# EAGLE design interfacing_board (EAGLE 9.1.0)
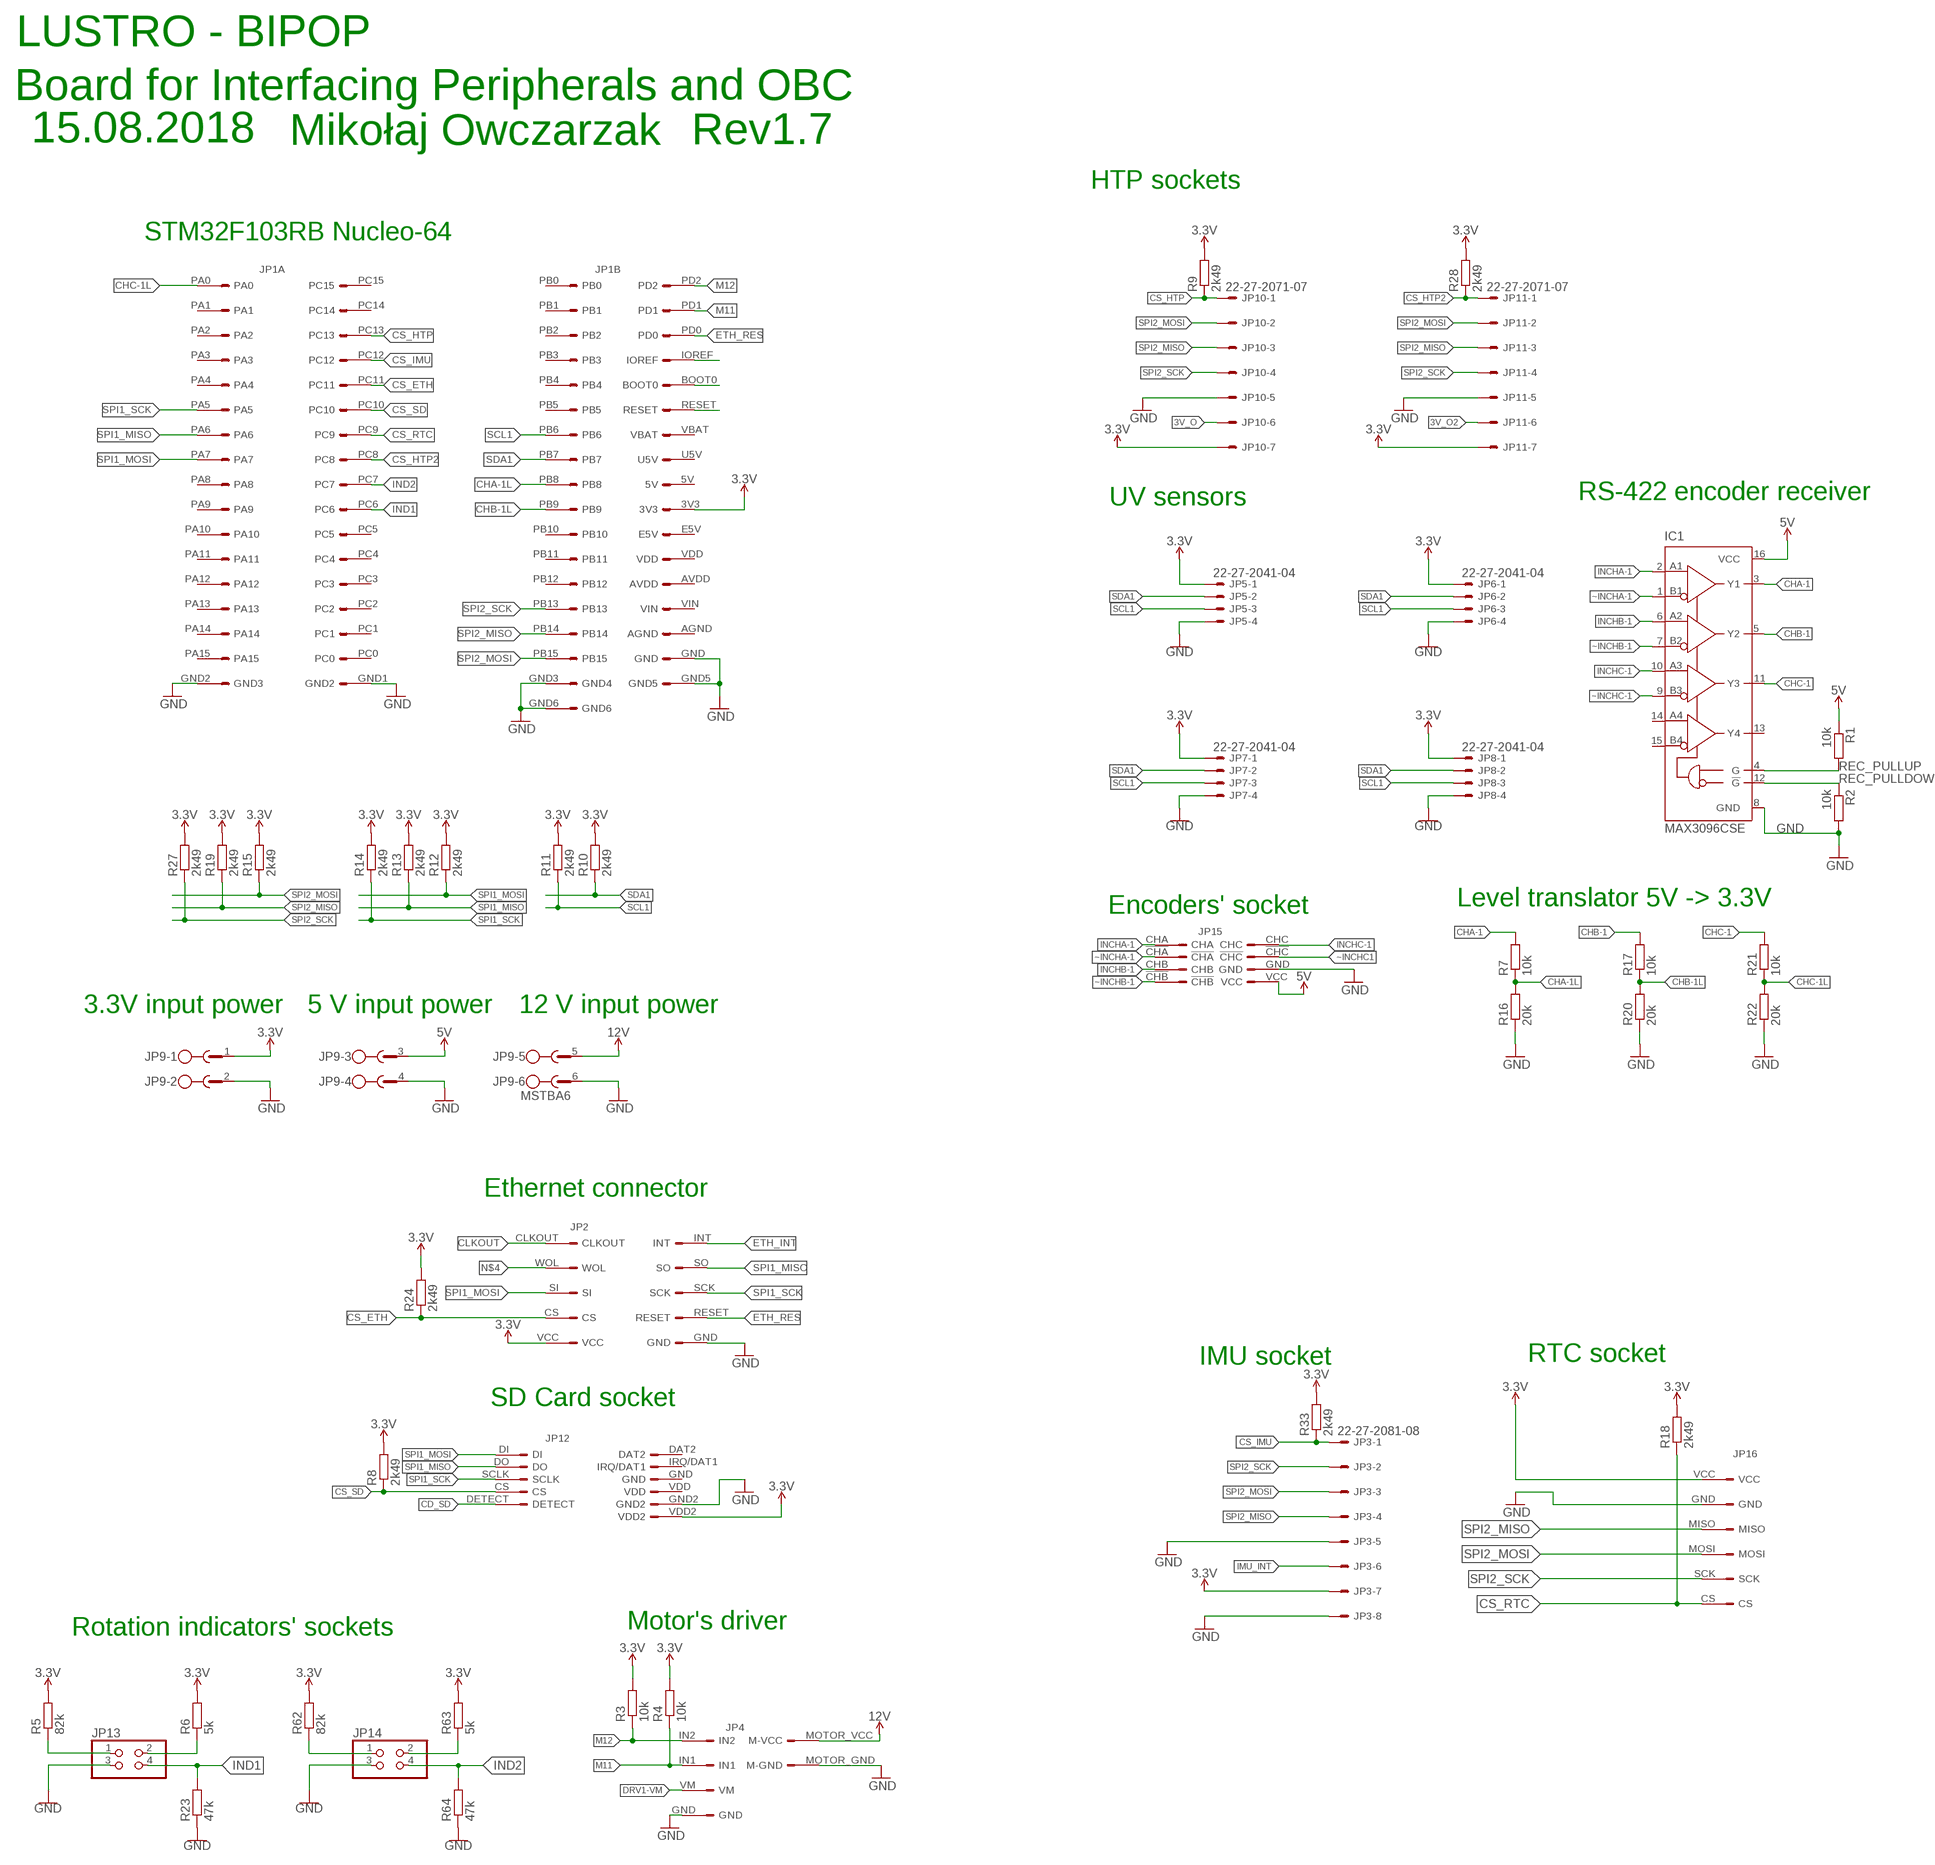
[diagram p0: schematic, sheet 1]

## Parts
IC1  MAX3096CSE  [SO16]
JP1A  JP1B  NUCLEOF103  [NUCLEO]
JP2  ETHERNET  [ETHERNET]
JP3  22-27-2081-08  [6410-08]
JP4  DRV8871  [DRIVER]
JP5  22-27-2041-04  [6410-04]
JP6  22-27-2041-04  [6410-04]
JP7  22-27-2041-04  [6410-04]
JP8  22-27-2041-04  [6410-04]
JP9  MSTBA6  [MSTBA6]
JP10  22-27-2071-07  [6410-07]
JP11  22-27-2071-07  [6410-07]
JP12  SD_2597  [SD]
JP13  PINHD-2X2  [2X02]
JP14  PINHD-2X2  [2X02]
JP15  ENX10  [SIL25]
JP16  RTC_WAVESHARE  [RTC]
R1  10k  R-EU_M0805  [M0805]
R2  10k  R-EU_M0805  [M0805]
R3  10k  R-EU_M0805  [M0805]
R4  10k  R-EU_M0805  [M0805]
R5  82k  R-EU_M0805  [M0805]
R6  5k  R-EU_M0805  [M0805]
R7  10k  R-EU_M0805  [M0805]
R8  2k49  R-EU_M0805  [M0805]
R9  2k49  R-EU_M0805  [M0805]
R10  2k49  R-EU_M0805  [M0805]
R11  2k49  R-EU_M0805  [M0805]
R12  2k49  R-EU_M0805  [M0805]
R13  2k49  R-EU_M0805  [M0805]
R14  2k49  R-EU_M0805  [M0805]
R15  2k49  R-EU_M0805  [M0805]
R16  20k  R-EU_M0805  [M0805]
R17  10k  R-EU_M0805  [M0805]
R18  2k49  R-EU_R0805  [R0805]
R19  2k49  R-EU_M0805  [M0805]
R20  20k  R-EU_M0805  [M0805]
R21  10k  R-EU_M0805  [M0805]
R22  20k  R-EU_M0805  [M0805]
R23  47k  R-EU_M0805  [M0805]
R24  2k49  R-EU_M0805  [M0805]
R27  2k49  R-EU_M0805  [M0805]
R28  2k49  R-EU_M0805  [M0805]
R33  2k49  R-EU_M0805  [M0805]
R62  82k  R-EU_M0805  [M0805]
R63  5k  R-EU_M0805  [M0805]
R64  47k  R-EU_M0805  [M0805]

## Nets
3.3V: JP1A.3V3 JP2.VCC JP3.7 JP5.1 JP6.1 JP7.1 JP8.1 JP9.1 JP10.7 JP11.7 JP12.VDD2 JP16.VCC R3.2 R4.2 R5.2 R6.2 R8.2 R9.2 R10.2 R11.2 R12.2 R13.2 R14.2 R15.2 R18.2 R19.2 R24.2 R27.2 R28.2 R33.2 R62.2 R63.2
3V_O: JP10.6
3V_O2: JP11.6
5V: IC1.16(VCC) JP9.3 JP15.VCC R1.1
12V: JP4.MOTOR_VCC(M-VCC) JP9.5
CD_SD: JP12.DETECT
CHA-1: IC1.3(Y1) R7.2
CHA-1L: JP1A.PB8 R7.1 R16.2
CHB-1: IC1.5(Y2) R17.2
CHB-1L: JP1A.PB9 R17.1 R20.2
CHC-1: IC1.11(Y3) R21.2
CHC-1L: JP1A.PA0 R21.1 R22.2
CLKOUT: JP2.CLKOUT
CS_ETH: JP1A.PC11 JP2.CS R24.1
CS_HTP: JP1A.PC13 JP10.1 R9.1
CS_HTP2: JP1A.PC8 JP11.1 R28.1
CS_IMU: JP1A.PC12 JP3.1 R33.1
CS_RTC: JP1A.PC9 JP16.CS R18.1
CS_SD: JP1A.PC10 JP12.CS R8.1
DRV1-VM: JP4.VM
ETH_INT: JP2.INT
ETH_RES: JP1A.PD0 JP2.RESET
GND: IC1.8(GND) JP1A.GND JP1A.GND1(GND2) JP1A.GND2(GND3) JP1A.GND3(GND4) JP1A.GND5 JP1A.GND6 JP2.GND JP3.5 JP3.8 JP4.GND JP4.MOTOR_GND(M-GND) JP5.4 JP6.4 JP7.4 JP8.4 JP9.2 JP9.4 JP9.6 JP10.5 JP11.5 JP12.GND2 JP13.3 JP14.3 JP15.GND JP16.GND R2.2 R16.1 R20.1 R22.1 R23.1 R64.1
IMU_INT: JP3.6
INCHA-1: IC1.2(A1) JP15.CHA
INCHB-1: IC1.6(A2) JP15.CHB
INCHC-1: IC1.10(A3) JP15.CHC
IND1: JP1A.PC6 JP13.4 R23.2
IND2: JP1A.PC7 JP14.4 R64.2
M11: JP1A.PD1 JP4.IN1 R4.1
M12: JP1A.PD2 JP4.IN2 R3.1
N$2: JP13.2 R6.1
N$4: JP2.WOL
N$7: JP13.1 R5.1
N$12: JP14.2 R63.1
N$15: JP14.1 R62.1
N$28: JP1A.RESET
N$29: JP1A.BOOT0
N$30: JP1A.IOREF
REC_PULLDOWN: IC1.12(!G) R2.1
REC_PULLUP: IC1.4(G) R1.2
SCL1: JP1A.PB6 JP5.3 JP6.3 JP7.3 JP8.3 R11.1
SDA1: JP1A.PB7 JP5.2 JP6.2 JP7.2 JP8.2 R10.1
SPI1_MISO: JP1A.PA6 JP2.SO JP12.DO R13.1
SPI1_MOSI: JP1A.PA7 JP2.SI JP12.DI R12.1
SPI1_SCK: JP1A.PA5 JP2.SCK JP12.SCLK R14.1
SPI2_MISO: JP1A.PB14 JP3.4 JP10.3 JP11.3 JP16.MISO R19.1
SPI2_MOSI: JP1A.PB15 JP3.3 JP10.2 JP11.2 JP16.MOSI R15.1
SPI2_SCK: JP1A.PB13 JP3.2 JP10.4 JP11.4 JP16.SCK R27.1
~INCHA-1: IC1.1(B1) JP15.!CHA
~INCHB-1: IC1.7(B2) JP15.!CHB
~INCHC1: JP15.!CHC
~INCHC-1: IC1.9(B3)
Unconnected: IC1.13(Y4) IC1.14(A4) IC1.15(B4) JP1A.5V JP1A.AGND JP1A.AVDD JP1A.E5V JP1A.PA1 JP1A.PA2 JP1A.PA3 JP1A.PA4 JP1A.PA8 JP1A.PA9 JP1A.PA10 JP1A.PA11 JP1A.PA12 JP1A.PA13 JP1A.PA14 JP1A.PA15 JP1A.PB0 JP1A.PB1 JP1A.PB2 JP1A.PB3 JP1A.PB4 JP1A.PB5 JP1A.PB10 JP1A.PB11 JP1A.PB12 JP1A.PC0 JP1A.PC1 JP1A.PC2 JP1A.PC3 JP1A.PC4 JP1A.PC5 JP1A.PC14 JP1A.PC15 JP1A.U5V JP1A.VBAT JP1A.VDD JP1A.VIN JP12.DAT2 JP12.GND JP12.IRQ/DAT1 JP12.VDD

## Notes on the sheet
- LUSTRO - BIPOP
- Board for Interfacing Peripherals and OBC
- 15.08.2018 | Mikołaj Owczarzak | Rev1.7
- HTP sockets
- STM32F103RB Nucleo-64
- UV sensors | RS-422 encoder receiver
- Encoders' socket | Level translator 5V -> 3.3V
- 3.3V input power | 5 V input power | 12 V input power
- Ethernet connector
- IMU socket | RTC socket
- SD Card socket
- Rotation indicators' sockets | Motor's driver

## Library data of the parts
IC1 = maxim:MAX309*: ±15kV ESD-Protected, 10Mbps, 3V/5V, Quad RS-422/RS-485 Receivers Source: http://pdfserv.maxim-ic.com/en/ds/MAX3095-MAX3096.pdf; MF: MAXIM; MPN: MAX3096CSE+; OC_FARNELL: unknown; OC_NEWARK: 67K4759
JP1A = customy:NUCLEOF103
JP2 = customy:ETHERNET
JP3 = EP_molex_6410_7395:22-?-08: CONNECTOR wire to board 2.54 mm (.1 inch) pitch header
JP4 = customy:DRV8871
JP5-JP8 = EP_molex_6410_7395:22-?-04: CONNECTOR wire to board 2.54 mm (.1 inch) pitch header
JP9 = con-phoenix-508:MSTBA6: PHOENIX; MF: FARNELL; MPN: 1757284; OC_FARNELL: 3705213; OC_NEWARK: 71C4165
JP10 JP11 = EP_molex_6410_7395:22-?-07: CONNECTOR wire to board 2.54 mm (.1 inch) pitch header
JP12 = customy:SD_2597
JP13 JP14 = pinhead:PINHD-2X2: PIN HEADER
JP15 = customy:ENX10
JP16 = customy:RTC_WAVESHARE
R1-R4 R7 R9-R22 R27 R28 R33 = rcl:R-EU_: RESISTOR, European symbol; SPICEPREFIX: R
R5 R6 R8 R23 R24 R62-R64 = resistor:R-EU_: RESISTOR, European symbol

## Board
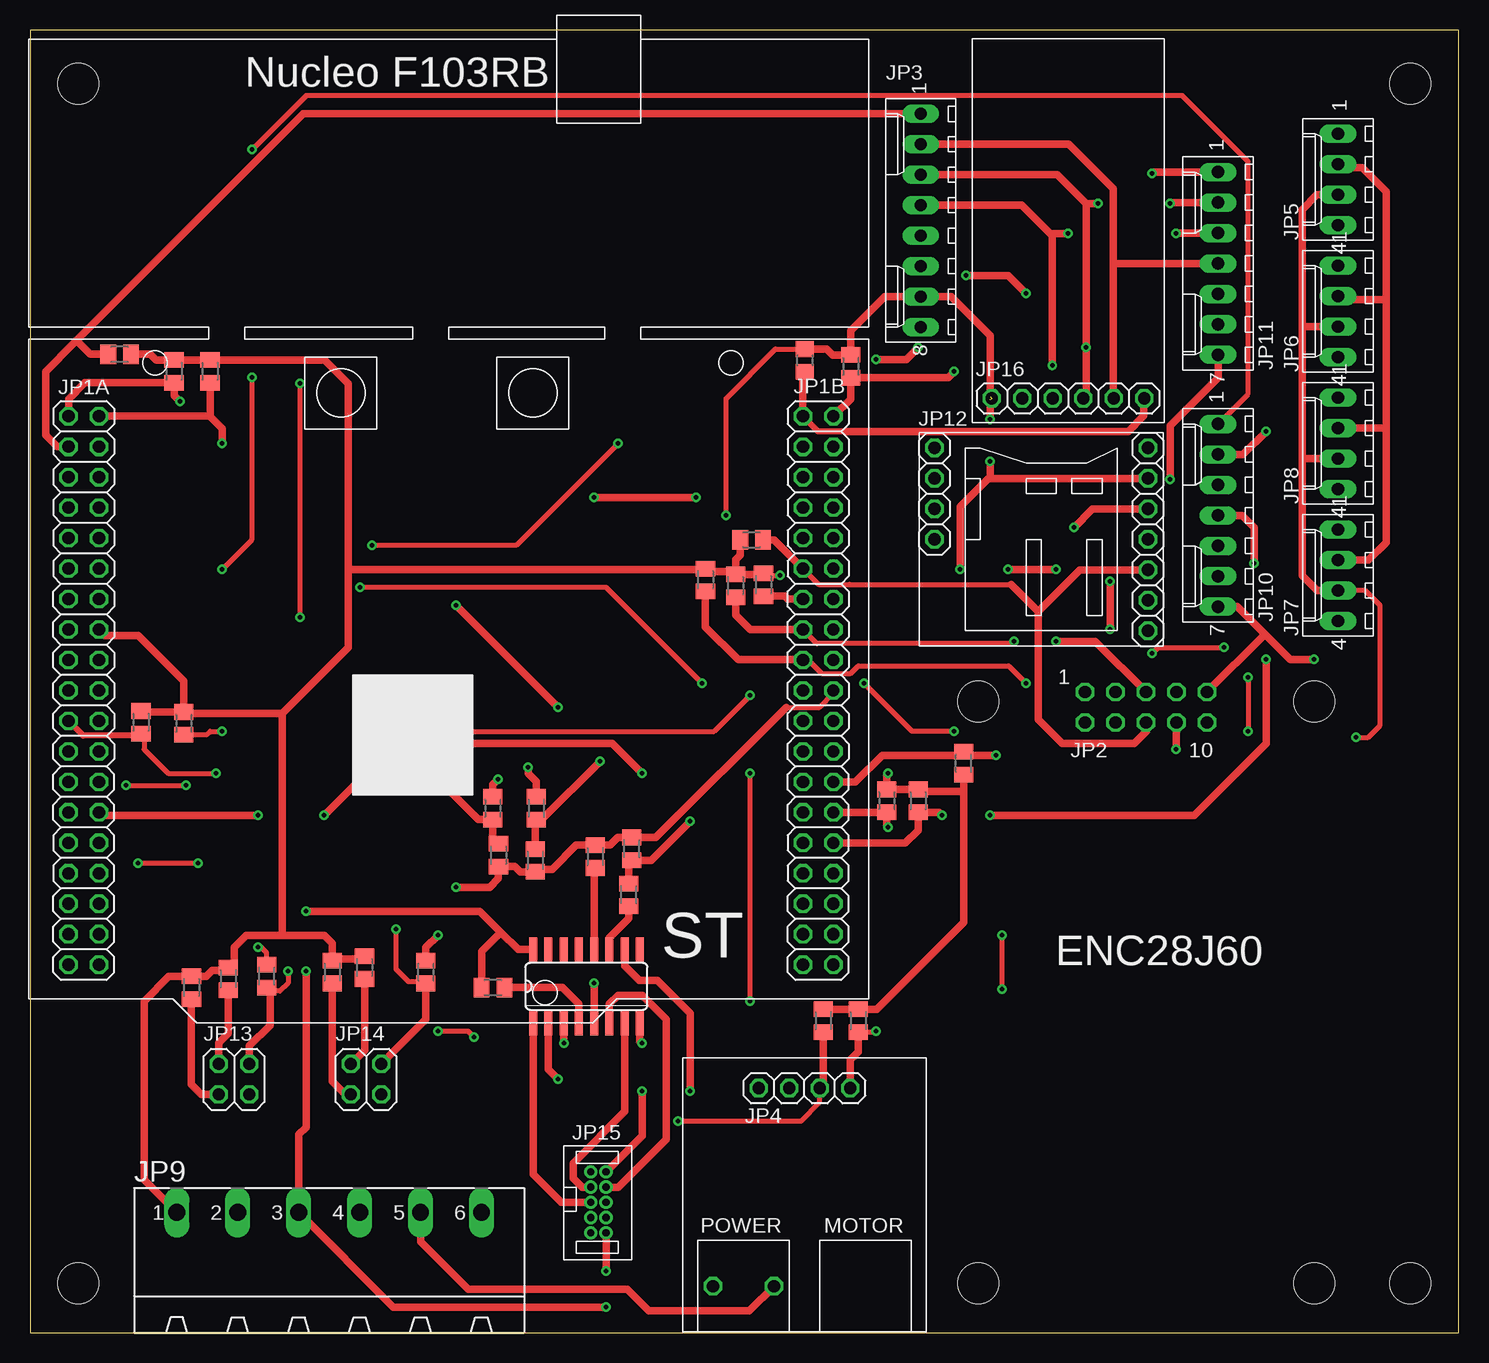
[diagram p1: board, top side]
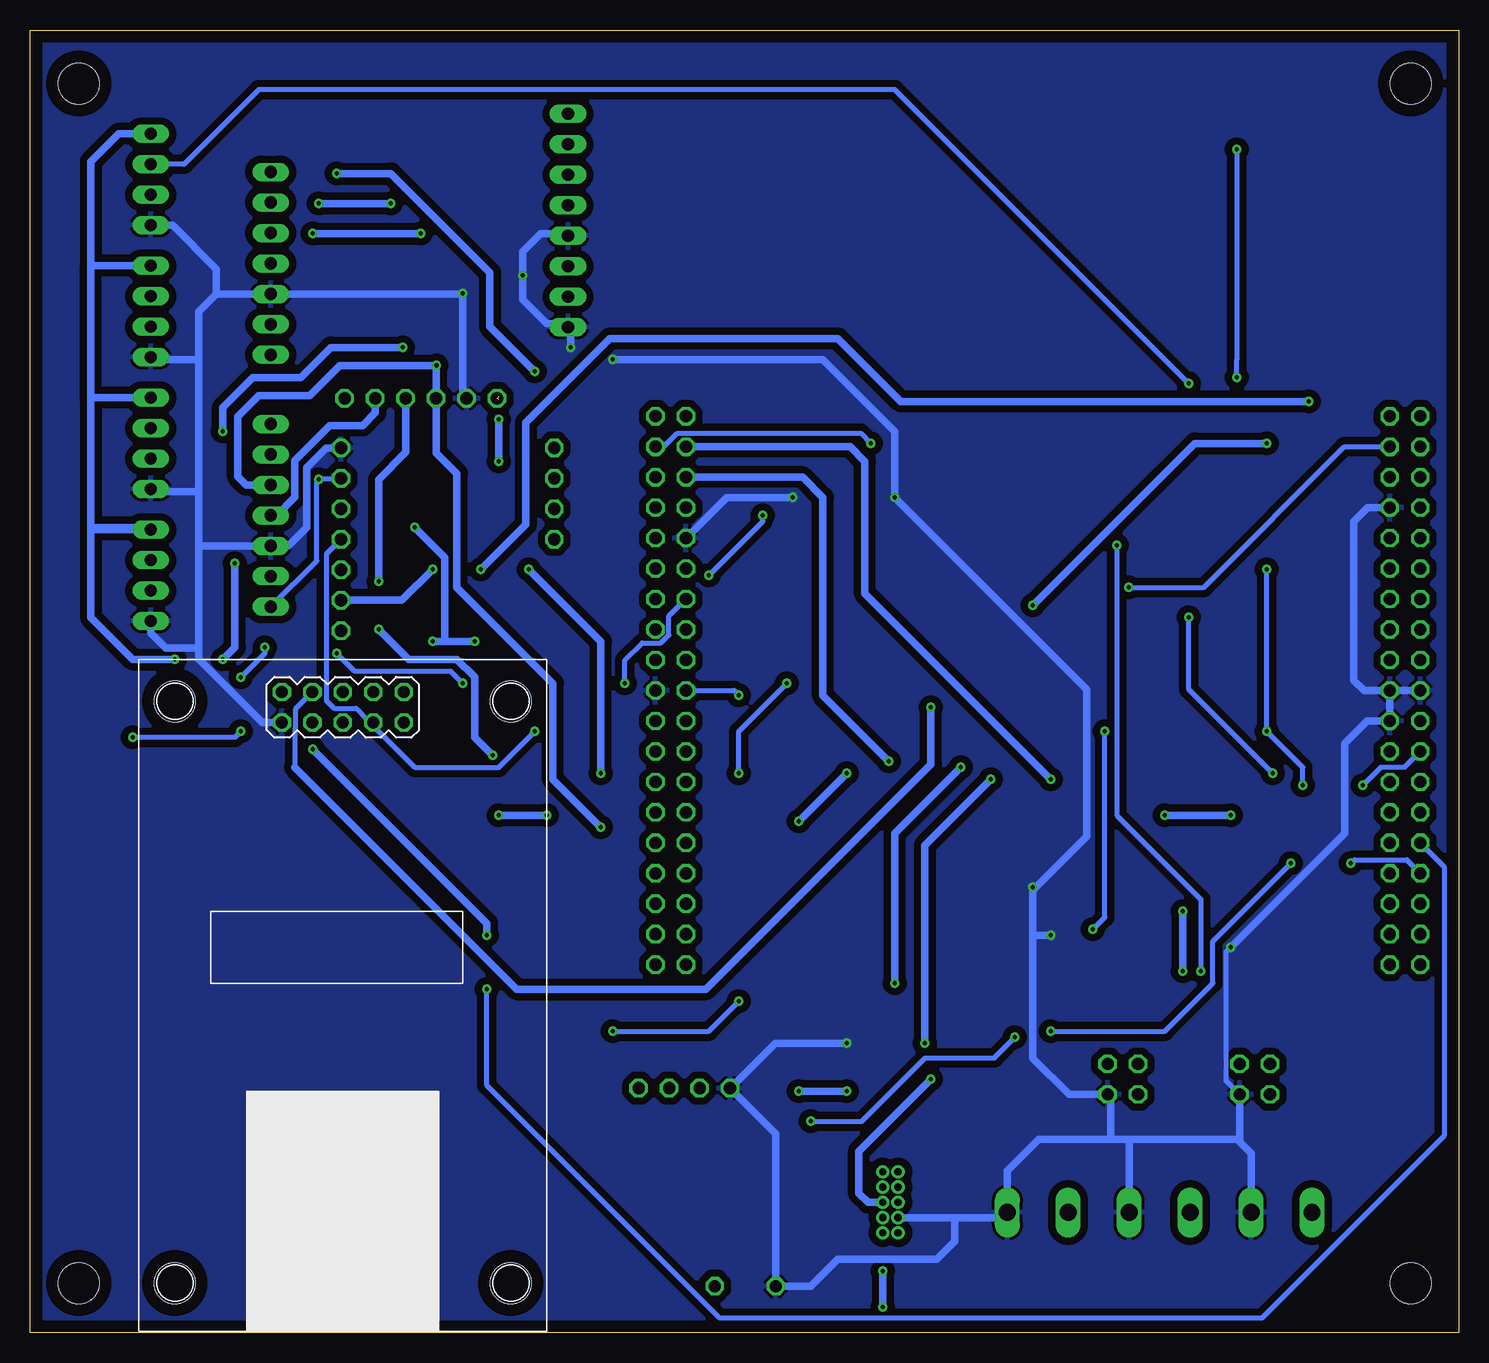
[diagram p2: board, bottom side, seen from below]

Size 119.07 x 108.6 mm. Coordinates in mm from the lower left corner, seen from the top.
Outline: 0,0 119.07,0 119.07,108.6 0,108.6 0,0
Copper layers (1*16): Top 0.035mm / dielectric 1.5mm / Bottom 0.035mm
Design rules "default": minimum track width 6mil, minimum drill 0.35mm, track to track 6mil, track to pad 6mil, pad to pad 6mil, via to via 6mil, smd to smd 6mil, copper to edge 40mil, drill to drill 6mil, minimum pad ring 10mil, minimum via ring 8mil, stop-mask expansion 4mil, vias tented up to drill 0mil, thermal gap 10mil
Holes 3.4 mm at 4,4.14 115,104.14 115,4.14 4,104.14 107,4.14 79,4.14 79,52.64 107,52.64

### Footprints (pad centres in the part's own frame; a part is rotated, then mirrored left to right if it is on the bottom)
SO16 = smd 0.66 x 2.032: 1 -4.445,-3.073; 2 -3.175,-3.073; 3 -1.905,-3.073; 4 -0.635,-3.073; 5 0.635,-3.073; 6 1.905,-3.073; 7 3.175,-3.073; 8 4.445,-3.073; 9 4.445,3.073; 10 3.175,3.073; 11 1.905,3.073; 12 0.635,3.073; 13 -0.635,3.073; 14 -1.905,3.073; 15 -3.175,3.073; 16 -4.445,3.073
NUCLEO = drill 1.016 octagon: 3V3 -27.25,-4.52; 5V -27.25,-7.06; 9 -29.79,3.1; 10 -27.25,3.1; 11 -29.79,0.56; 26 -27.25,-17.22; 48 33.95,3.1; 74 33.95,-29.92; 76 33.95,-32.46; AGND 33.95,-24.84; AVDD 31.41,5.64; BOOT0 -29.79,5.64; E5V -27.25,8.18; GND -27.25,5.64; GND1 -29.79,-9.6; GND2 -27.25,-9.6; GND3 -27.25,-12.14; GND5 31.41,3.1; GND6 33.95,-9.6; IOREF -27.25,0.56; PA0 -27.25,-19.76; PA1 -27.25,-22.3; PA2 31.41,-29.92; PA3 31.41,-32.46; PA4 -27.25,-24.84; PA5 31.41,0.56; PA6 31.41,-1.98; PA7 31.41,-4.52; PA8 31.41,-14.68; PA9 31.41,-12.14; PA10 31.41,-27.38; PA11 33.95,-1.98; PA12 33.95,0.56; PA13 -29.79,-1.98; PA14 -29.79,-4.52; PA15 -29.79,-7.06; PB0 -27.25,-27.38; PB1 33.95,-14.68; PB2 33.95,-12.14; PB3 31.41,-24.84; PB4 31.41,-19.76; PB5 31.41,-22.3; PB6 31.41,-7.06; PB7 -29.79,-12.14; PB8 31.41,10.72; PB9 31.41,8.18; PB10 31.41,-17.22; PB11 33.95,-7.06; PB12 33.95,-4.52; PB13 33.95,-22.3; PB14 33.95,-19.76; PB15 33.95,-17.22; PC0 -27.25,-32.46; PC1 -27.25,-29.92; PC2 -29.79,-29.92; PC3 -29.79,-32.46; PC4 33.95,-27.38; PC5 33.95,8.18; PC6 33.95,10.72; PC7 31.41,-9.6; PC8 33.95,13.26; PC9 31.41,13.26; PC10 -29.79,13.26; PC11 -27.25,13.26; PC12 -29.79,10.72; PC13 -29.79,-14.68; PC14 -29.79,-17.22; PC15 -29.79,-19.76; PD0 -29.79,-22.3; PD1 -29.79,-24.84; PD2 -27.25,10.72; RESET -27.25,-1.98; U5V 33.95,5.64; VBAT -29.79,-27.38; VDD -29.79,8.18; VIN -27.25,-14.68
ETHERNET = drill 1.016 octagon: CLKOUT 11.92,2.73; CS 19.54,2.73; GND 22.08,5.27; INT 11.92,5.27; RESET 19.54,5.27; SCK 17,5.27; SI 17,2.73; SO 14.46,5.27; VCC 22.08,2.73; WOL 14.46,2.73
6410-08 = drill 1.016 long: 1 8.89,0; 2 6.35,0; 3 3.81,0; 4 1.27,0; 5 -1.27,0; 6 -3.81,0; 7 -6.35,0; 8 -8.89,0
DRIVER = drill 1.016 octagon: GND 1.27,0; IN1 -3.81,0; IN2 -6.35,0; MOTOR_GND 5.08,16.51; MOTOR_VCC 0,16.51; VM -1.27,0
6410-04 = drill 1.016 long: 1 3.81,0; 2 1.27,0; 3 -1.27,0; 4 -3.81,0
MSTBA6 = drill 1.397 long: 1 -12.7,5.08; 2 -7.62,5.08; 3 -2.54,5.08; 4 2.54,5.08; 5 7.62,5.08; 6 12.7,5.08
6410-07 = drill 1.016 long: 1 7.62,0; 2 5.08,0; 3 2.54,0; 4 0,0; 5 -2.54,0; 6 -5.08,0; 7 -7.62,0
SD = drill 1.016 octagon: CS 10.16,-5.08; DAT2 -7.62,2.54; DETECT 10.16,-7.62; DI 10.16,2.54; DO 10.16,0; GND -7.62,7.62; GND2 10.16,7.62; IRQ/DAT1 -7.62,0; SCLK 10.16,-2.54; VDD -7.62,5.08; VDD2 10.16,5.08
2X02 = drill 1.016 octagon: 1 -1.27,-1.27; 2 -1.27,1.27; 3 1.27,-1.27; 4 1.27,1.27
SIL25 = drill 0.6 pad 1.016: !CHA -1.27,0.27; !CHB 0,0.27; !CHC 1.27,0.27; CHA -1.27,-1; CHB 0,-1; CHC 1.27,-1; DNC -3.81,0.27; DNC2 -2.54,-1; GND -2.54,0.27; VCC -3.81,-1
RTC = drill 1.016 octagon: CS 6.35,0; GND -3.81,0; MISO -1.27,0; MOSI 1.27,0; SCK 3.81,0; VCC -6.35,0
M0805 = smd 1.3 x 1.6: 1 -0.95,0; 2 0.95,0
R0805 = smd 1.3 x 1.5: 1 -0.95,0; 2 0.95,0

### Placement (x,y rotation side)
IC1  46.37,28.88 0 top
JP1A  33,63.14 0 top
JP2  76,56.14 180 bottom
JP3  74.23,92.72 90 top
JP4  62,20.39 180 top
JP5  109,96.14 90 top
JP6  109,85.14 90 top
JP7  109,63.14 90 top
JP8  109,74.14 90 top
JP9  24.93,4.95 0 top
JP10  99,68.14 90 top
JP11  99,89.14 90 top
JP12  83,66.14 0 top
JP13  17,21.14 0 top
JP14  28,21.14 0 top
JP15  47,12.14 90 top
JP16  86.5,77.89 0 top
R1  38.58,28.77 0 top
R2  47.1,39.7 90 top
R3  69.02,26.01 90 top
R4  66.1,26.01 90 top
R5  13.45,28.77 90 top
R6  16.53,29.5 90 top
R7  38.56,43.72 90 top
R8  12,80.14 90 top
R9  12.82,50.8 90 top
R10  9.25,50.88 90 top
R11  56.29,62.75 90 top
R12  58.8,62.27 90 top
R13  61.12,62.35 90 top
R14  60.14,66.1 180 top
R15  77.8,47.48 270 top
R16  39.04,39.81 90 top
R17  42.18,43.72 90 top
R18  64.58,81.05 90 top
R19  71.39,44.34 90 top
R20  42.1,39.37 90 top
R21  49.9,36.5 270 top
R22  50.14,40.34 270 top
R23  19.72,29.72 270 top
R24  15,80.14 90 top
R27  74.01,44.34 90 top
R28  68.39,80.56 90 top
R33  7.47,81.56 0 top
R62  25.18,30.07 90 top
R63  27.88,30.45 90 top
R64  32.99,30.07 270 top

### Tracks (layer width: path | path; a pad name or v marks a point on that pad's centre or on a via)
3.3V  (via drill 0.35)  (2 unrouted)
  Top 0.406: R13.2 61.28,63.14 v62.5,63.14 | v58,68.14 58,77.89 62.11,82 R18.2
  Top 0.61: R13.2 61.04,63.22 R12.2 | R33.2 10.03,81.56 10.5,81.09 R8.2 R24.2 24.55,81.09 26.5,79.14 26.5,63.64 | R12.2 58.8,64.46 59.19,64.85 R14.2 | R18.2 66.4,82 66.89,81.51 R28.2 68.39,83.53 71.23,86.37 JP3.7 76.77,86.37 80,83.14 80,78.03 | R4.2 R3.2 70.57,26.96 77.8,34.19 R15.2 77.8,45.14 75.75,45.14 74.16,45.14 R27.2 R19.2 71.39,46.53 v71.5,46.64 | R9.2 9.33,51.75 R10.2 | JP1A.3V3 6.23,58.14 9,58.14 12.82,54.32 R9.2 | 21,33.14 18,33.14 17,32.14 17,30.92 R6.2 16.28,30.2 15.18,30.2 14.7,29.72 R5.2 11.58,29.72 9.5,27.64 9.5,12.76 JP9.1 | 21,33.14 24.5,33.14 25.18,32.46 R62.2 25.43,31.02 25.56,31.15 27.88,31.15 R63.2 | v107,56.14 105,56.14 103,58.14 | JP10.7 100.62,60.52 103,58.14 | JP2.VCC 102.81,58.14 103,58.14 | JP12.VDD2 80,71.22 80,71.39 | v80,76.14 80,77.79 | R9.2 12.93,51.64 21,51.64 | 21,51.64 21,33.14 | 80,71.39 77.5,68.89 v77.5,63.64 | 80,71.39 v80,72.64 | 21,51.64 22.5,53.14 26.5,57.14 26.5,63.64 | 26.5,63.64 56.23,63.64 R11.2 56.52,63.47 58.55,63.47 R12.2 | v95,71.14 95,75.64 99,79.64 JP11.7
  Bottom 0.406: JP10.7 95.17,64.35 95.17,70.97 v95,71.14 94.92,71.22 JP12.VDD2 | v62.5,63.14 58,67.64 v58,68.14 | 113.75,77.95 113.94,77.76 114,77.76
  Bottom 0.61: JP8.1 113.75,77.95 | JP6.1 114,88.95 | JP5.1 111.69,99.95 114,97.64 114,88.95 | v107,56.14 110.5,56.14 114,59.64 114,66.95 JP7.1 109.19,67.14 114,67.14 114,77.76 114,88.95 | v80,72.64 v80,76.14 | v71.5,46.64 71.5,57.64 v77.5,63.64
5V  (via drill 0.35)
  Top 0.61: v48,2.14 30.28,2.14 JP9.3 22.39,16.53 23,17.14 v23,30.14 | v23,35.14 37.49,35.14 38.62,34.01 39.24,33.38 | 39.24,33.38 40.67,31.95 IC1.16 | JP15.VCC v48,5.14 | R1.1 37.63,31.77 39.24,33.38
  Bottom 0.61: v23,30.14 v23,35.14 | v48,5.14 v48,2.14
12V
  Top 0.61: JP9.5 32.55,7.59 36.5,3.64 49.75,3.64 51.57,1.82 59.94,1.82 JP4.MOTOR_VCC
CHA-1  (via drill 0.35)
  Top 0.61: R7.2 38.56,45.7 v39,46.14 | v44.5,24.14 44.47,24.14 IC1.3
  Bottom 0.61: v39,46.14 44.5,40.64 v44.5,24.14
CHA-1L  (via drill 0.35)
  Top 0.61: R16.2 38.56,41.24 R7.1 37.37,42.77 v34,46.14
  Bottom 0.61: v34,46.14 49.5,61.64 49.5,72.64 50.72,73.86 JP1A.PB8
CHB-1  (via drill 0.35)
  Top 0.61: IC1.5 v47,29.14 | v41.5,47.14 41.5,46.64 42.18,45.96 R17.2
  Bottom 0.61: v47,29.14 47,41.64 v41.5,47.14
CHB-1L  (via drill 0.35)
  Top 0.61: R20.2 42.1,42.69 R17.1 42.63,42.77 v47.5,47.64
  Bottom 0.61: v47.5,47.64 53,53.14 53,69.64 54.68,71.32 JP1A.PB9
CHC-1
  Top 0.61: IC1.11 48.27,32.92 49.9,34.55 R21.2
CHC-1L  (via drill 0.35)
  Top 0.61: R21.1 49.9,39.15 R22.2 51.75,39.39 v55,42.64 | JP1A.PA0 5.99,43.14 v19,43.14 | v24.5,43.14 30.5,49.14 48.5,49.14 v51,46.64
  Bottom 0.61: v19,43.14 v24.5,43.14 | v51,46.64 v55,42.64
CS_ETH  (via drill 0.35)
  Top 0.61: 14.99,76.4 15,76.4 R24.1 | v44,52.14 v35.5,60.64 | 14.99,76.4 16,75.39 v16,74.14 | JP1A.PC11 14.26,76.4 14.99,76.4
  Bottom 0.406: 97,47.14 97,50.37 96.96,50.41 96.96,51.99 JP2.CS
  Bottom 0.61: 97,47.14 78.5,28.64 62.75,28.64 44,47.39 v44,52.14 | v35.5,60.64 22,74.14 v16,74.14
CS_HTP  (via drill 0.35)
  Top 0.406: R9.1 14.71,49.85 15,50.14 v16,50.14 | v16,63.64 18.5,66.14 v18.5,79.64 | JP10.1 101.5,78.26 101.5,97.64 96,103.14 23,103.14 v18.5,98.64 | v8,45.64 v13,45.64
  Bottom 0.406: v16,63.64 v16,50.14 15.75,49.89 13,47.14 v13,45.64 | v18.5,79.64 18.5,81.14 v18.5,98.64 | JP1A.PC13 4.5,47.17 4.5,47.14 6.5,47.14 v8,45.64
CS_HTP2  (via drill 0.35)
  Top 0.61: JP1A.PC8 68.39,77.84 R28.1 68.42,79.64 76.5,79.64 v77,80.14 | JP11.1 93.62,96.76 v93.5,96.64
  Bottom 0.61: v93.5,96.64 89,96.64 80.75,88.39 80.75,83.89 v77,80.14
CS_IMU
  Top 0.61: JP3.1 22.79,101.61 4.66,83.48 3.66,82.48 | JP1A.PC12 2.28,73.86 1.32,74.82 1.32,80.14 3.66,82.48 | R33.1 5.02,81.56 3.88,82.7 3.66,82.48
CS_RTC
  Top 0.508: 68,75.14 65.67,75.14 JP1A.PC9
  Top 0.61: JP1A.PC9 64.41,79.93 R18.1 | 68,75.14 78,75.14 91.5,75.14 92.82,76.46 92.82,77.86 JP16.CS
CS_SD  (via drill 0.35)
  Top 0.61: JP1A.PC10 3.21,77.85 4.55,79.19 R8.1 12,78.14 v12.5,77.64 | v81.5,63.64 v85.5,63.64
  Bottom 0.61: v12.5,77.64 46.5,77.64 51.75,82.89 70.75,82.89 77.75,75.89 77.75,67.39 v81.5,63.64 | v85.5,63.64 88.08,61.06 JP12.CS
ETH_RES  (via drill 0.35)
  Top 0.406: v81,28.64 v81,33.14
  Top 0.61: JP2.RESET 95.54,48.68 v95.5,48.64
  Bottom 0.406: JP1A.PD0 1.22,38.85 1.22,16.42 16.42,1.22 61.58,1.22 69.5,9.14 81,20.64 v81,28.64
  Bottom 0.61: v95.5,48.64 81,34.14 v81,33.14
GND  (via drill 0.35)
  Top 0.406: 63,52.14 65.8,52.14 66.95,53.29 JP1A.GND6 | v19,32.14 19.25,32.14 19.72,31.67 R23.1
  Top 0.61: v51,24.14 51,24.12 50.81,24.31 IC1.8 | R64.1 32.99,32.13 v34,33.14 | v83,86.64 81.5,88.14 v78,88.14 | v35.5,37.14 38.32,37.14 39.04,37.86 R16.1 40.41,38.86 40.85,38.42 R20.1 42.32,38.64 43.5,38.64 45.51,40.65 R2.2 48.35,40.65 48.99,41.29 R22.1 52.15,41.29 63,52.14 | v55.5,69.64 v47,69.64 | v74,82.14 73,81.14 v70.5,81.14
  Bottom 0.406: JP13.3 19.39,20.99 19.39,31.75 v19,32.14 | 105.06,57.08 105,57.14 | JP1A.GND5
  Bottom 0.61: 103.54,86.6 JP11.5 83,86.6 83,78.25 | 103.54,86.6 105,85.14 105,81.14 | JP6.4 108.81,81.14 105,81.14 | JP5.4 107.19,92.33 103.54,88.68 103.54,87.1 103.54,86.6 | 105,70.14 105,80.14 105,81.14 | 105,70.14 106,70.14 108.81,70.14 JP8.4 | 105,65.39 105,70.14 | 105,65.39 104.79,65.6 JP10.5 97.54,65.6 96,67.14 96,72.14 94.38,73.76 JP12.GND2 | JP2.GND 99.73,50.87 104.94,56.08 105,56.14 105,57.14 105,65.14 105,65.39 | JP9.2 17.31,14.95 18.27,15.91 18.27,16.14 | 18.27,16.14 JP13.3 | 29,16.14 35,16.14 37.63,13.51 JP9.6 38.06,9.6 42,9.6 | 29,16.14 27,16.14 26.5,16.14 | 29,16.14 29,19.6 JP14.3 32.48,19.87 35.5,22.89 35.5,32.64 35.5,33.14 | JP9.4 27.47,16.14 27.5,16.14 26.5,16.14 | JP15.GND 42,9.6 | 42,9.6 42,7.64 43.5,6.14 51.75,6.14 54.01,3.88 JP4.MOTOR_GND 56.92,16.58 JP4.GND 56.98,24.14 v51,24.14 | 35.5,33.14 v34,33.14 | 35.5,33.14 35.5,33.64 v35.5,37.14 35.38,37.02 31,41.39 31,53.64 v47,69.64 47,75.14 53,81.14 v70.5,81.14 | v19,32.14 9.5,41.64 9.5,49.14 7.64,51 JP1A.GND3 JP1A.GND2 | v74,82.14 74,83.6 JP3.8 74.54,84.14 76,84.14 78,86.14 78,87.64 v78,88.14 78,90.14 76.5,91.64 74.42,91.64 JP3.5 | JP1A.GND5 61,69.64 v55.5,69.64 | 26.5,16.14 18.27,16.14 | JP7.4 109,58.33 107.75,57.08 105.06,57.08 105.06,57.2 | JP1A.GND2 JP1A.GND1 | JP1A.GND2 7.9,53.54 8.75,54.39 8.75,67.64 7.61,68.78 JP1A.GND
  pour Bottom (isolate 0.61): 0.5,108.14 118.5,108.14 118.5,0.64 0.5,0.64
INCHA-1  (via drill 0.35)
  Top 0.61: v44,21.14 43.2,21.95 IC1.2
  Bottom 0.61: JP15.CHA 49.23,10.87 50,11.64 50,15.14 46,19.14 v44,21.14
INCHB-1
  Top 0.61: IC1.6 48.27,27.41 49,28.14 51,28.14 53,26.14 53,16.14 49,12.14 JP15.CHB
INCHC-1  (via drill 0.35)
  Top 0.61: JP15.CHC 51,16.41 v51,20.14 | v55,20.14 55,26.64 52.25,29.39 50.75,29.39 49.55,30.59 IC1.10
  Bottom 0.61: v51,20.14 v55,20.14
IND1  (via drill 0.35)
  Top 0.406: v49,74.14 40.5,65.64 v28.5,65.64 | v21.5,30.14 21.5,29.14 20.85,28.49 20,28.49
  Top 0.61: JP13.4 18.27,23.91 20,25.64 20,28.49 R23.2
  Bottom 0.406: JP1A.PC6 66.24,73.86 65.12,74.98 55.41,74.98 54.66,74.98 54.16,74.98 53.66,74.98 49.84,74.98 v49,74.14 | v28.5,65.64 28.5,43.14 21.5,36.14 v21.5,30.14
IND2  (via drill 0.35)
  Top 0.406: v60,53.14 57,50.14 v29.5,50.14 | R64.2 32.85,29.26 31.54,29.26 30.5,30.31 v30.5,33.64
  Top 0.61: R64.2 32.99,26.13 JP14.4
  Bottom 0.406: JP1A.PC7 60.4,53.54 v60,53.14 | v30.5,33.64 29.5,34.64 v29.5,50.14
M11  (via drill 0.35)
  Top 0.406: v54,17.64 64.25,17.64 65.81,19.2 JP4.IN1 | v37,24.64 36.5,25.14 v34,25.14 | v14,39.14 v9,39.14
  Top 0.61: R4.1 66.1,20.81 65.81,20.52 JP4.IN1
  Bottom 0.406: v54,17.64 49.75,17.64 44.48,22.91 38.7,22.91 37,24.6 v37,24.64 | v34,25.14 24.5,25.14 20.5,29.14 20.5,32.64 v14,39.14 | v9,39.14 v8.99,39.14 8.71,39.42 4.33,39.42 JP1A.PD1
M12  (via drill 0.35)
  Top 0.406: R3.1 70.42,25.06 v70.5,25.14 | v60,27.64 v60,46.64 | v56,54.14 48,62.14 v27.5,62.14
  Top 0.61: R3.1 69.02,23.4 68.35,22.73 JP4.IN2
  Bottom 0.406: v70.5,25.14 62.5,25.14 v60,27.64 | v60,46.64 60,50.14 v56,54.14 | v27.5,62.14 21.25,62.14 9.53,73.86 JP1A.PD2
N$2
  Top 0.61: R6.1 16.53,24.96 15.73,24.16 JP13.2
N$7
  Top 0.61: R5.1 13.45,20.69 14.27,19.87 JP13.1
N$12
  Top 0.61: R63.1 27.88,23.52 26.77,22.41 JP14.2
N$15
  Top 0.61: R62.1 25.18,20.96 26.27,19.87 JP14.1
REC_PULLDOWN
  Top 0.61: R2.1 47.01,38.66 IC1.12
REC_PULLUP
  Top 0.61: IC1.4 45.73,27.41 44.37,28.77 R1.2
SCL1  (via drill 0.35)
  Top 0.406: v83,54.14 81.56,55.58 69.03,55.58 68.41,54.96 65.99,54.96 64.87,56.08 JP1A.PB6 | v93.5,56.64 94,57.14 v99.5,57.14 | v101.5,54.64 v101.5,50.14 | JP7.3 111.27,61.87 112.5,60.64 112.5,50.64 111.5,49.64 v110.5,49.64 | 106,72.85 106,72.87
  Top 0.61: JP1A.PB6 64.35,56.14 59,56.14 56.29,58.85 R11.1 | JP5.3 107.23,94.87 106,93.64 106,85.14 | 106,85.14 106,83.87 JP6.3 | JP7.3 107.27,61.87 106,63.14 106,72.85 | 106,85.14 106,72.87 JP8.3
  Bottom 0.406: v83,54.14 84,55.14 92,55.14 v93.5,56.64 | v101.5,54.64 99.5,56.64 v99.5,57.14 | v101.5,50.14 102,49.64 v110.5,49.64
SDA1  (via drill 0.35)
  Top 0.406: R10.1 9.5,49.68 9.5,48.64 11.5,46.64 v15.5,46.64 | v22.5,59.64 v22.5,79.14
  Top 0.508: JP1A.PB7 4.43,49.78 9.1,49.78 R10.1
  Top 0.61: JP5.2 109.27,97.14 111,97.14 113,95.14 113,86.14 | 113,86.14 109.27,86.14 JP6.2 | 113,75.41 111.27,75.41 JP8.2 | 113,75.41 113,85.14 113,86.14 | JP7.2 111.52,64.41 113,65.89 113,75.41
  Bottom 0.406: v15.5,46.64 22.5,53.64 v22.5,59.64 | v22.5,79.14 47,103.64 100,103.64 106.23,97.41 JP5.2
SPI1_MISO  (via drill 0.35)
  Top 0.406: v77,50.14 73.5,50.14 v69.5,54.14
  Top 0.61: R13.1 62.91,61.41 63.16,61.16 JP1A.PA6
  Bottom 0.406: JP12.DO 94.37,64.93 94.37,52.7 93.71,52.04 91.9,52.04 90.96,51.1 90.69,51.1 JP2.SO 90.46,50.6 87,47.14 80,47.14 v77,50.14 | v69.5,54.14 69.5,56.07 68.07,57.5 66.49,57.5 65.83,58.16 65.83,59.74 JP1A.PA6
SPI1_MOSI  (via drill 0.35)
  Top 0.406: v82,57.64 81.81,57.45 65.58,57.45 JP1A.PA7
  Top 0.61: JP1A.PA7 60.02,58.62 58.8,59.84 R12.1 | JP2.SI 88.77,57.64 v85.5,57.64 | v87,67.14 88.54,68.68 JP12.DI
  Bottom 0.61: v85.5,57.64 84.5,57.64 | 84.5,57.64 v82,57.64 | v87,67.14 84.5,64.64 84.5,57.64
SPI1_SCK
  Top 0.406: 81.75,62.39 68.3,62.39 65.72,62.39 JP1A.PA5
  Top 0.61: JP1A.PA5 62.73,65.38 62.01,66.1 R14.1 | JP2.SCK 93,50.14 92,49.14 86,49.14 84,51.14 84,60.14 | 84,60.14 87.46,63.6 JP12.SCLK | 84,60.14 81.75,62.39
SPI2_MISO  (via drill 0.35)
  Top 0.61: JP1A.PB14 R19.1 71.39,42.25 v71.5,42.14 | JP3.4 82.65,93.99 85.2,91.44 85.2,90.94 | JP11.3 95.54,91.68 v95.5,91.64 | v86.5,91.64 85.2,91.64 85.2,90.94 | 85.2,90.94 v85.2,80.64
  Bottom 0.61: v95.5,91.64 v86.5,91.64 | JP10.3 101.04,70.68 101.75,71.39 101.75,76.39 100,78.14 95.75,78.14 93.25,80.64 v85.2,80.64 85.23,80.61 JP16.MISO 85.2,77.86 85.2,73.34 83.5,71.64 83.5,62.14 75.5,54.14 75.5,46.14 v71.5,42.14
SPI2_MOSI  (via drill 0.35)
  Top 0.61: JP1A.PB15 68.78,45.92 71,48.14 77.51,48.14 R15.1 78.09,48.14 v80.5,48.14 | JP3.3 85.61,96.53 88,94.14 | 88,94.14 v88,82.14 88,78.12 JP16.MOSI | 88,94.14 v89,94.14 | v95,94.14 95.08,94.22 JP11.2 | JP10.2 101.08,73.22 v103,75.14 | v90,62.64 v90,58.64
  Bottom 0.61: v89,94.14 v95,94.14 | v103,75.14 103,77.14 100.5,79.64 96.5,79.64 94,82.14 v88,82.14 | v90,62.64 90,71.14 87.74,73.4 87.74,77.86 JP16.MOSI | v90,58.64 87.5,56.14 83.5,56.14 82.02,54.66 82.02,51.39 82,51.37 82,49.64 v80.5,48.14
SPI2_SCK  (via drill 0.35)
  Top 0.61: JP1A.PB13 72.95,40.84 74,41.89 R27.1 75.75,43.39 v76,43.14 | JP3.2 86.57,99.07 90.28,95.36 90.28,89.14 | JP11.4 90.28,89.14 | v80,43.14 97,43.14 103,49.14 v103,56.14 | v102,64.14 102,67.14 101,68.14 JP10.4 | 90.28,89.14 90.28,77.92 JP16.SCK
  Bottom 0.61: v76,43.14 v80,43.14 | v103,56.14 102,57.14 v102,64.14 | JP10.4 99,68.19 98.55,68.19 98.5,68.14 97.02,69.67 97.02,72.7 94.08,75.64 91.34,75.64 90.28,76.7 90.28,77.86 JP16.SCK
~INCHA-1
  Top 0.61: JP15.!CHA 44.27,10.87 41.92,13.21 IC1.1
~INCHB-1
  Top 0.61: JP15.!CHB 46,12.14 45.25,12.89 45.25,14.14 49.55,18.44 IC1.7